# EAGLE board genesys (EAGLE 9.5.1), part 1 of 2
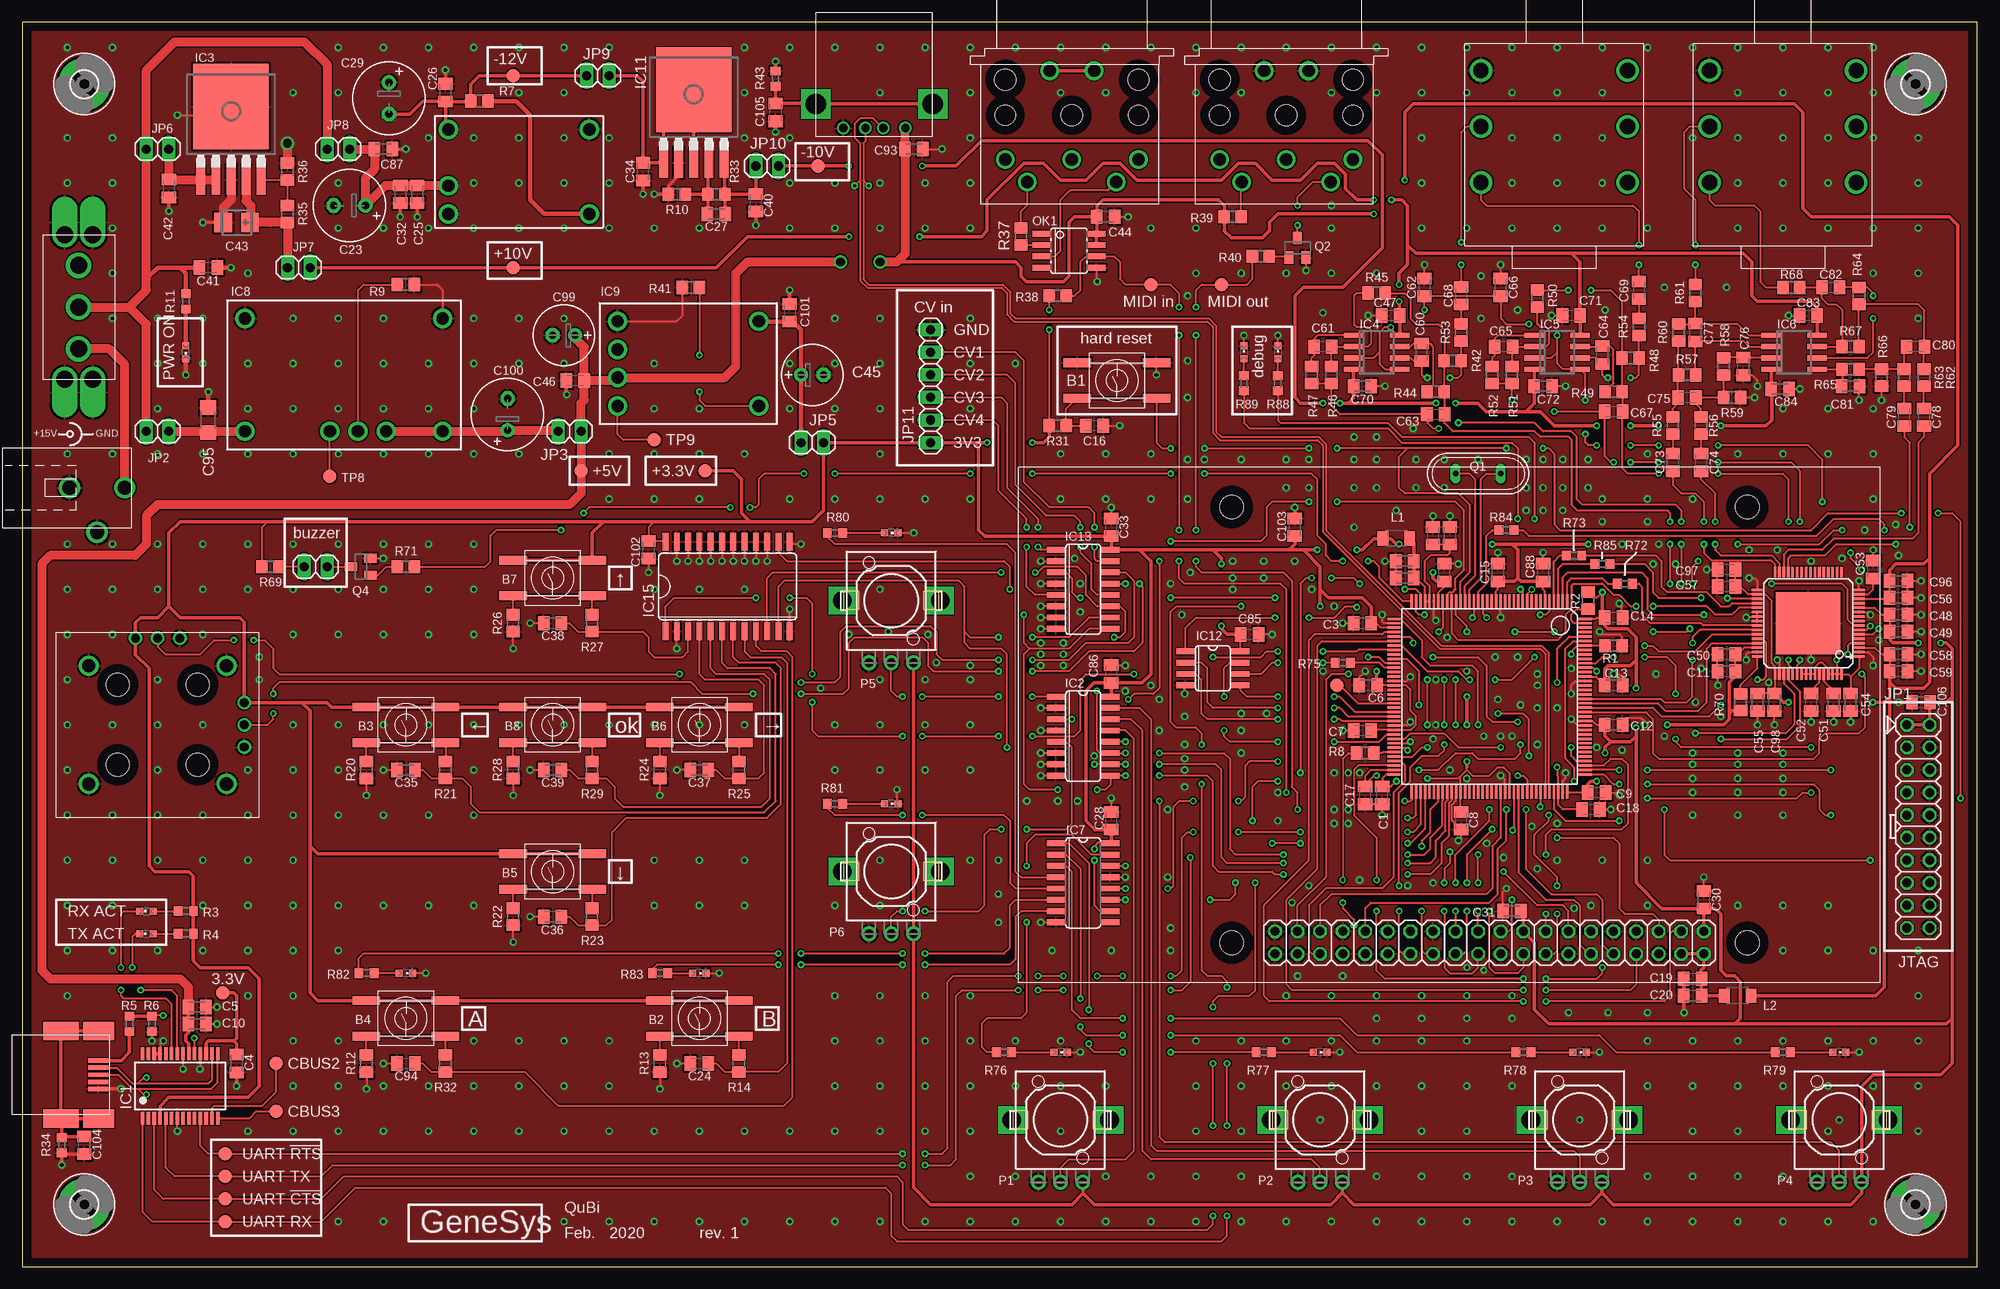
[diagram p16: board, top side]
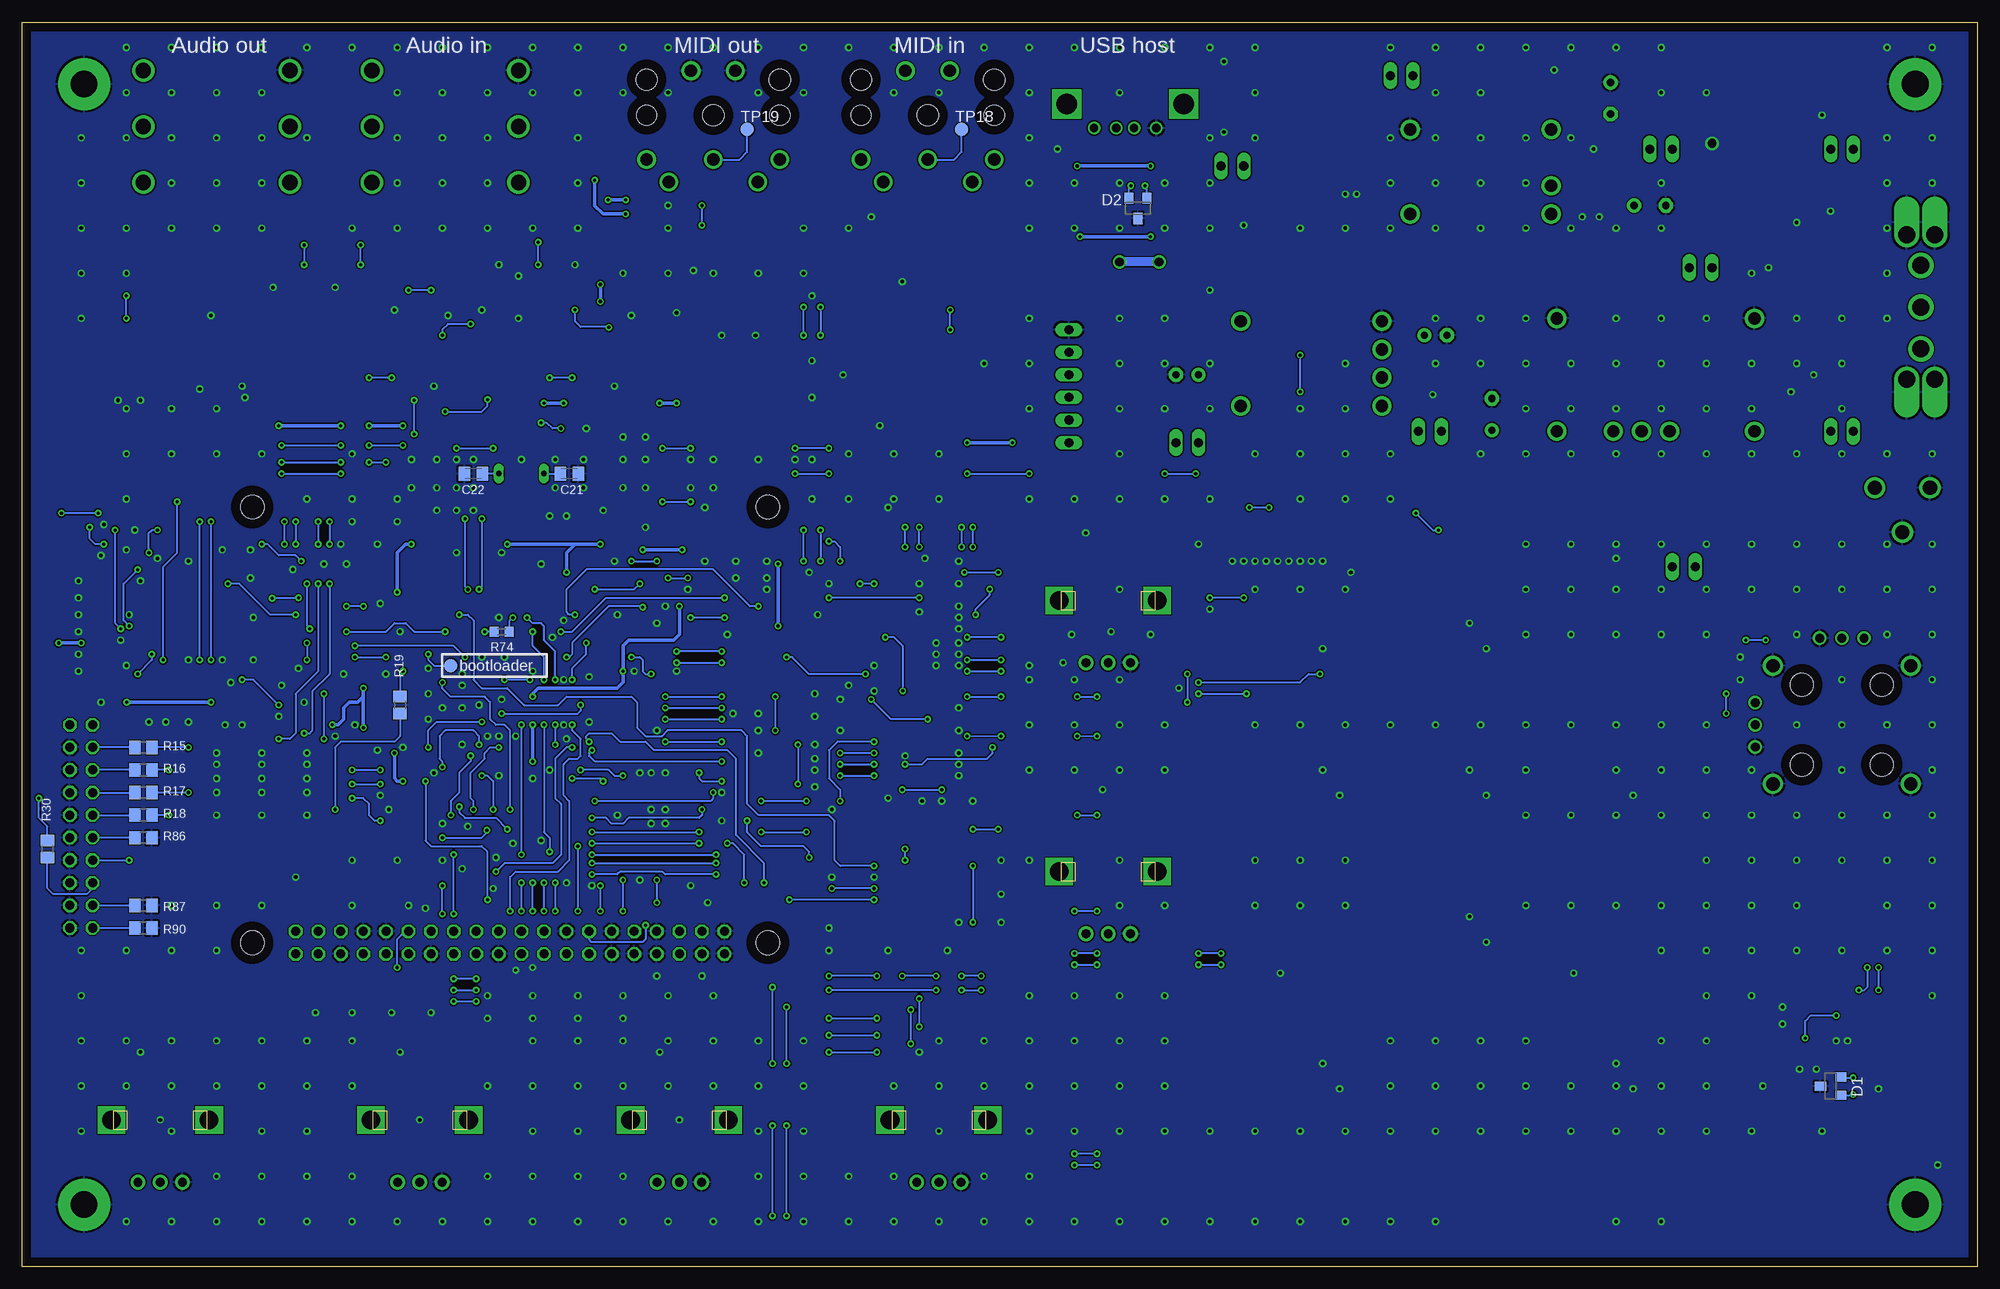
[diagram p17: board, bottom side, seen from below]

Size 220 x 140 mm. Coordinates in mm from the lower left corner, seen from the top.
Outline: 0,0 220,0 220,140 0,140 0,0
Copper layers (1*16): Top 0.035mm / dielectric 1.5mm / Bottom 0.035mm
Design rules "jlcpcb": minimum track width 5mil, minimum drill 0.3mm, track to track 6mil, track to pad 6mil, pad to pad 6mil, via to via 6mil, smd to smd 6mil, copper to edge 40mil, drill to drill 6mil, minimum pad ring 10mil, minimum via ring 8mil, stop-mask expansion 4mil, vias tented up to drill 0mil, thermal gap 10mil
Net classes: 1 USB diff pair: width 0.203 mm, clearance 0.025 mm

## Footprints (pad centres in the part's own frame; a part is rotated, then mirrored left to right if it is on the bottom)
KSC521G = smd 3.1 x 1: 1 -4.45,2; 2 4.45,2; 3 4.45,-2; 4 -4.45,-2
C0805K = smd 1.3 x 1.6: 1 -1,0; 2 1,0
E3,5-8 = drill 0.813 pad 1.6: + -1.778,0 | drill 0.813 pad 1.6 octagon: - 1.778,0
CT3528 = smd 2 x 2.2: + -1.5,0; - 1.5,0
E2,5-7 = drill 0.813 pad 1.6: + -1.27,0 | drill 0.813 pad 1.6 octagon: - 1.27,0
C1206 = smd 1.6 x 1.8: 1 -1.4,0; 2 1.4,0
SOT23 = smd 1.016 x 1.27: 1 -1.016,-1.143; 2 1.016,-1.143; 3 0,1.143
3,0-PAD = drill 3 pad 5.842: B3,0 0,0
SSOP28 = smd 0.4 x 1.5: 1 -4.225,-3.625; 2 -3.575,-3.625; 3 -2.925,-3.625; 4 -2.275,-3.625; 5 -1.625,-3.625; 6 -0.975,-3.625; 7 -0.325,-3.625; 8 0.325,-3.625; 9 0.975,-3.625; 10 1.625,-3.625; 11 2.275,-3.625; 12 2.925,-3.625; 13 3.575,-3.625; 14 4.225,-3.625; 15 4.225,3.625; 16 3.575,3.625; 17 2.925,3.625; 18 2.275,3.625; 19 1.625,3.625; 20 0.975,3.625; 21 0.325,3.625; 22 -0.325,3.625; 23 -0.975,3.625; 24 -1.625,3.625; 25 -2.275,3.625; 26 -2.925,3.625; 27 -3.575,3.625; 28 -4.225,3.625
SO16 = smd 0.66 x 2.032: 1 -4.445,-3.073; 2 -3.175,-3.073; 3 -1.905,-3.073; 4 -0.635,-3.073; 5 0.635,-3.073; 6 1.905,-3.073; 7 3.175,-3.073; 8 4.445,-3.073; 9 4.445,3.073; 10 3.175,3.073; 11 1.905,3.073; 12 0.635,3.073; 13 -0.635,3.073; 14 -1.905,3.073; 15 -3.175,3.073; 16 -4.445,3.073
Q5-DD = smd 1 x 3.4: 1 -3.4,-7.875; 2 -1.7,-7.875; 3 0,-7.875; 4 1.7,-7.875; 5 3.4,-7.875 | smd 8.5 x 9.6: 6 0,0.325
SO08 = smd 0.6 x 2.2: 1 -1.905,-2.6; 2 -0.635,-2.6; 3 0.635,-2.6; 4 1.905,-2.6; 5 1.905,2.6; 6 0.635,2.6; 7 -0.635,2.6; 8 -1.905,2.6
R-PDSS-T7 = drill 1.397 pad 2.184: 1 -11.113,6.35; 2 -11.113,-6.35; 3 -1.587,-6.35; 4 1.587,-6.35; 5 4.763,-6.35; 6 11.113,-6.35; 7 11.113,6.35
R-PDSS-T6 = drill 1.397 pad 2.184: 1 -7.938,4.763; 2 -7.938,1.587; 3 -7.938,-1.587; 4 -7.938,-4.763; 5 7.938,-4.763; 6 7.938,4.763
R-PDSS-T5 = drill 1.397 pad 2.184: 1 -7.938,4.763; 2 -7.938,-1.587; 3 -7.938,-4.763; 4 7.938,-4.763; 5 7.938,4.763
Q5-DD' = smd 1 x 3.4: 1 -3.4,-5.335; 2 -1.7,-5.335; 3 0,-5.335; 4 1.7,-5.335; 5 3.4,-5.335 | smd 8.5 x 9.6: 6 0,2.865
SO8 = smd 0.66 x 2.032: 1 -1.905,-3.073; 2 -0.635,-3.073; 3 0.635,-3.073; 4 1.905,-3.073; 5 1.905,3.073; 6 0.635,3.073; 7 -0.635,3.073; 8 -1.905,3.073
SO24W = smd 0.66 x 2.032: 1 -6.985,-5.029; 2 -5.715,-5.029; 3 -4.445,-5.029; 4 -3.175,-5.029; 5 -1.905,-5.029; 6 -0.635,-5.029; 7 0.635,-5.029; 8 1.905,-5.029; 9 3.175,-5.029; 10 4.445,-5.029; 11 5.715,-5.029; 12 6.985,-5.029; 13 6.985,5.029; 14 5.715,5.029; 15 4.445,5.029; 16 3.175,5.029; 17 1.905,5.029; 18 0.635,5.029; 19 -0.635,5.029; 20 -1.905,5.029; 21 -3.175,5.029; 22 -4.445,5.029; 23 -5.715,5.029; 24 -6.985,5.029
56579-0579 = smd 2.25 x 0.5: DN 2.225,0.8; DP 2.225,0; GND 2.225,-1.6; NC 2.225,-0.8; VBUS 2.225,1.6 | smd 4 x 2.05: SHIELD@1 -2,4.925; SHIELD@4 -2,-4.925 | smd 3.5 x 2.05: SHIELD@2 2.25,4.925; SHIELD@3 2.25,-4.925
USB_A = drill 0.92: P1 -3.5,2.71; P2 -1,2.71; P3 1,2.71; P4 3.5,2.71 | drill 2.3 square: SHIELD@1 -6.57,0; SHIELD@2 6.57,0
JACK_6.35 = drill 1.7: P1 -8.25,-6.3; P2 -8.25,0; P3 -8.25,6.3; P4 8.25,-6.3; P5 8.25,0; P6 8.25,6.3
71251-050/0800 = drill 1.4: GND@1 -2.5,-5; GND@2 2.5,-5; P1 7.5,5; P2 0,5; P3 -7.5,5; P4 5,7.5; P5 -5,7.5 | hole 2.3: -7.5,0; 7.5,0 | hole 2.4: -7.5,-4; 7.5,-4; 0,0
DC-10LP = drill 1.6: P1 0,-6.45; P2 -5,-3.35; P3 0,-0.25
2X10 = drill 1.016 octagon: 1 -11.43,-1.27; 2 -11.43,1.27; 3 -8.89,-1.27; 4 -8.89,1.27; 5 -6.35,-1.27; 6 -6.35,1.27; 7 -3.81,-1.27; 8 -3.81,1.27; 9 -1.27,-1.27; 10 -1.27,1.27; 11 1.27,-1.27; 12 1.27,1.27; 13 3.81,-1.27; 14 3.81,1.27; 15 6.35,-1.27; 16 6.35,1.27; 17 8.89,-1.27; 18 8.89,1.27; 19 11.43,-1.27; 20 11.43,1.27
1X02 = drill 1.016 long: 1 -1.27,0; 2 1.27,0
1X06 = drill 1.016 long: 1 -6.35,0; 2 -3.81,0; 3 -1.27,0; 4 1.27,0; 5 3.81,0; 6 6.35,0
L3216C = smd 1.2 x 1.6: 1 -1.5,0; 2 1.5,0
CHIPLED_0603 = smd 0.8 x 0.8: A 0,-0.75; C 0,0.75
SOIC08 = smd 0.66 x 2.032: 1 -1.905,-3.073; 2 -0.635,-3.073; 3 0.635,-3.073; 4 1.905,-3.073; 5 1.905,3.073; 6 0.635,3.073; 7 -0.635,3.073; 8 -1.905,3.073
EVUFXM = drill 1 pad 1.676: 1 -2.5,-7; 2 0,-7; 3 2.5,-7 | drill 2.1 pad 2.8 square: M1 -5.5,0; M2 5.5,0
RKJXK1210002 = drill 1: PX1 2.5,9.75; PX2 0,9.75; PX3 -2.5,9.75; PY1 9.75,-2.5; PY2 9.75,0; PY3 9.75,2.5 | drill 1.5: SHIELD@1 -7.75,-6.65; SHIELD@2 -7.75,6.65; SHIELD@3 7.75,6.65; SHIELD@4 7.75,-6.65 | hole 2.6: -4.5,4.5; 4.5,4.5; 4.5,-4.5; -4.5,-4.5
QS = drill 0.61 long: 1 -2.54,0; 2 2.54,0
SOT23' = smd 1 x 1.4: 1 -0.95,-1.1; 2 0.95,-1.1; 3 0,1.1
R0805 = smd 1.3 x 1.5: 1 -0.95,0; 2 0.95,0
R0603 = smd 1 x 1.1: 1 -0.85,0; 2 0.85,0
SWITCH_1P = drill 1.905: P1 0,-4.699; P2 0,0; P3 0,4.699 | drill 1.905 offset: SHIELD@1 1.587,8.128; SHIELD@2 -1.587,8.128; SHIELD@3 -1.587,-8.128; SHIELD@4 1.587,-8.128
TP15R = smd 1.5 x 1.5: TP 0,0
TQFP144 = smd 0.27 x 1.5: 1 -8.75,-10.75; 2 -8.25,-10.75; 3 -7.75,-10.75; 4 -7.25,-10.75; 5 -6.75,-10.75; 6 -6.25,-10.75; 7 -5.75,-10.75; 8 -5.25,-10.75; 9 -4.75,-10.75; 10 -4.25,-10.75; 11 -3.75,-10.75; 12 -3.25,-10.75; 13 -2.75,-10.75; 14 -2.25,-10.75; 15 -1.75,-10.75; 16 -1.25,-10.75; 17 -0.75,-10.75; 18 -0.25,-10.75; 19 0.25,-10.75; 20 0.75,-10.75; 21 1.25,-10.75; 22 1.75,-10.75; 23 2.25,-10.75; 24 2.75,-10.75; 25 3.25,-10.75; 26 3.75,-10.75; 27 4.25,-10.75; 28 4.75,-10.75; 29 5.25,-10.75; 30 5.75,-10.75; 31 6.25,-10.75; 32 6.75,-10.75; 33 7.25,-10.75; 34 7.75,-10.75; 35 8.25,-10.75; 36 8.75,-10.75; 73 8.75,10.75; 74 8.25,10.75; 75 7.75,10.75; 76 7.25,10.75; 77 6.75,10.75; 78 6.25,10.75; 79 5.75,10.75; 80 5.25,10.75; 81 4.75,10.75; 82 4.25,10.75; 83 3.75,10.75; 84 3.25,10.75; 85 2.75,10.75; 86 2.25,10.75; 87 1.75,10.75; 88 1.25,10.75; 89 0.75,10.75; 90 0.25,10.75; 91 -0.25,10.75; 92 -0.75,10.75; 93 -1.25,10.75; 94 -1.75,10.75; 95 -2.25,10.75; 96 -2.75,10.75; 97 -3.25,10.75; 98 -3.75,10.75; 99 -4.25,10.75; 100 -4.75,10.75; 101 -5.25,10.75; 102 -5.75,10.75; 103 -6.25,10.75; 104 -6.75,10.75; 105 -7.25,10.75; 106 -7.75,10.75; 107 -8.25,10.75; 108 -8.75,10.75 | smd 1.5 x 0.27: 37 10.75,-8.75; 38 10.75,-8.25; 39 10.75,-7.75; 40 10.75,-7.25; 41 10.75,-6.75; 42 10.75,-6.25; 43 10.75,-5.75; 44 10.75,-5.25; 45 10.75,-4.75; 46 10.75,-4.25; 47 10.75,-3.75; 48 10.75,-3.25; 49 10.75,-2.75; 50 10.75,-2.25; 51 10.75,-1.75; 52 10.75,-1.25; 53 10.75,-0.75; 54 10.75,-0.25; 55 10.75,0.25; 56 10.75,0.75; 57 10.75,1.25; 58 10.75,1.75; 59 10.75,2.25; 60 10.75,2.75; 61 10.75,3.25; 62 10.75,3.75; 63 10.75,4.25; 64 10.75,4.75; 65 10.75,5.25; 66 10.75,5.75; 67 10.75,6.25; 68 10.75,6.75; 69 10.75,7.25; 70 10.75,7.75; 71 10.75,8.25; 72 10.75,8.75; 109 -10.75,8.75; 110 -10.75,8.25; 111 -10.75,7.75; 112 -10.75,7.25; 113 -10.75,6.75; 114 -10.75,6.25; 115 -10.75,5.75; 116 -10.75,5.25; 117 -10.75,4.75; 118 -10.75,4.25; 119 -10.75,3.75; 120 -10.75,3.25; 121 -10.75,2.75; 122 -10.75,2.25; 123 -10.75,1.75; 124 -10.75,1.25; 125 -10.75,0.75; 126 -10.75,0.25; 127 -10.75,-0.25; 128 -10.75,-0.75; 129 -10.75,-1.25; 130 -10.75,-1.75; 131 -10.75,-2.25; 132 -10.75,-2.75; 133 -10.75,-3.25; 134 -10.75,-3.75; 135 -10.75,-4.25; 136 -10.75,-4.75; 137 -10.75,-5.25; 138 -10.75,-5.75; 139 -10.75,-6.25; 140 -10.75,-6.75; 141 -10.75,-7.25; 142 -10.75,-7.75; 143 -10.75,-8.25; 144 -10.75,-8.75
HYPERPIXEL4.0 = drill 1.016 octagon: 1 -24.13,23.23; 2 -24.13,25.77; 3 -21.59,23.23; 4 -21.59,25.77; 5 -19.05,23.23; 6 -19.05,25.77; 7 -16.51,23.23; 8 -16.51,25.77; 9 -13.97,23.23; 10 -13.97,25.77; 11 -11.43,23.23; 12 -11.43,25.77; 13 -8.89,23.23; 14 -8.89,25.77; 15 -6.35,23.23; 16 -6.35,25.77; 17 -3.81,23.23; 18 -3.81,25.77; 19 -1.27,23.23; 20 -1.27,25.77; 21 1.27,23.23; 22 1.27,25.77; 23 3.81,23.23; 24 3.81,25.77; 25 6.35,23.23; 26 6.35,25.77; 27 8.89,23.23; 28 8.89,25.77; 29 11.43,23.23; 30 11.43,25.77; 31 13.97,23.23; 32 13.97,25.77; 33 16.51,23.23; 34 16.51,25.77; 35 19.05,23.23; 36 19.05,25.77; 37 21.59,23.23; 38 21.59,25.77; 39 24.13,23.23; 40 24.13,25.77 | hole 2.7: 29,-24.5; 29,24.5; -29,24.5; -29,-24.5
HTQFP64 = smd 1.2 x 0.3: 1 -5.75,3.75; 2 -5.75,3.25; 3 -5.75,2.75; 4 -5.75,2.25; 5 -5.75,1.75; 6 -5.75,1.25; 7 -5.75,0.75; 8 -5.75,0.25; 9 -5.75,-0.25; 10 -5.75,-0.75; 11 -5.75,-1.25; 12 -5.75,-1.75; 13 -5.75,-2.25; 14 -5.75,-2.75; 15 -5.75,-3.25; 16 -5.75,-3.75; 33 5.75,-3.75; 34 5.75,-3.25; 35 5.75,-2.75; 36 5.75,-2.25; 37 5.75,-1.75; 38 5.75,-1.25; 39 5.75,-0.75; 40 5.75,-0.25; 41 5.75,0.25; 42 5.75,0.75; 43 5.75,1.25; 44 5.75,1.75; 45 5.75,2.25; 46 5.75,2.75; 47 5.75,3.25; 48 5.75,3.75 | smd 0.3 x 1.2: 17 -3.75,-5.75; 18 -3.25,-5.75; 19 -2.75,-5.75; 20 -2.25,-5.75; 21 -1.75,-5.75; 22 -1.25,-5.75; 23 -0.75,-5.75; 24 -0.25,-5.75; 25 0.25,-5.75; 26 0.75,-5.75; 27 1.25,-5.75; 28 1.75,-5.75; 29 2.25,-5.75; 30 2.75,-5.75; 31 3.25,-5.75; 32 3.75,-5.75; 49 3.75,5.75; 50 3.25,5.75; 51 2.75,5.75; 52 2.25,5.75; 53 1.75,5.75; 54 1.25,5.75; 55 0.75,5.75; 56 0.25,5.75; 57 -0.25,5.75; 58 -0.75,5.75; 59 -1.25,5.75; 60 -1.75,5.75; 61 -2.25,5.75; 62 -2.75,5.75; 63 -3.25,5.75; 64 -3.75,5.75 | smd 7.26 x 7: GND 0,0

## Placement (x,y rotation side)
B1  KSC521G  [KSC521G]  123.19,99.69 0 top
B2  KSC521G  [KSC521G]  76.2,27.94 0 top
B3  KSC521G  [KSC521G]  43.18,60.96 0 top
B4  KSC521G  [KSC521G]  43.18,27.94 0 top
B5  KSC521G  [KSC521G]  59.69,44.45 0 top
B6  KSC521G  [KSC521G]  76.2,60.96 0 top
B7  KSC521G  [KSC521G]  59.69,77.47 0 top
B8  KSC521G  [KSC521G]  59.69,60.96 0 top
C1  100n  [C0805K]  153.03,53.02 270 top
C2  100n  [C0805K]  160.02,78.11 90 top
C3  100n  [C0805K]  150.81,72.39 180 top
C4  100n  [C0805K]  24.13,22.86 270 top
C5  4.7µF  [C0805K]  19.68,29.21 0 top
C6  100n  [C0805K]  151.45,65.41 180 top
C7  100n  [C0805K]  150.81,60.33 180 top
C8  100n  [C0805K]  161.93,50.16 270 top
C9  100n  [C0805K]  177.16,53.34 0 top
C10  100n  [C0805K]  19.68,27.3 0 top
C11  10µF  [C0805K]  191.77,66.99 180 top
C12  100n  [C0805K]  179.07,60.96 0 top
C13  100n  [C0805K]  179.07,65.41 0 top
C14  100n  [C0805K]  179.07,73.03 0 top
C15  100n  [C0805K]  166.05,78.11 90 top
C16  100n  [C0805K]  120.65,94.61 0 top
C17  2.2µF  [C0805K]  151.13,53.02 270 top
C18  2.2µF  [C0805K]  176.53,51.44 0 top
C19  100n  [C0805K]  187.96,32.38 180 top
C20  10µF  [C0805K]  187.96,30.48 180 top
C21  5.6pF  [C0805K]  158.43,89.22 0 bottom
C22  5.6pF  [C0805K]  169.23,89.22 180 bottom
C23  180µF  [E3,5-8]  36.83,119.38 180 top
C24  100nF  [C0805K]  76.2,22.86 180 top
C25  4.7µF  [C0805K]  44.45,120.65 270 top
C26  4.7µF  [C0805K]  47.62,132.08 270 top
C27  10nF  [C0805K]  78.11,118.43 0 top
C28  100n  [C0805K]  122.56,50.16 90 top
C29  180µF  [E3,5-8]  41.27,131.44 270 top
C30  100n  [C0805K]  189.23,41.27 90 top
C31  100n  [C0805K]  167.64,40.01 180 top
C32  4.7µF  [C0805K]  42.55,120.65 270 top
C33  100n  [C0805K]  122.56,83.19 90 top
C34  10µF  [C0805K]  69.85,123.19 90 top
C35  100nF  [C0805K]  43.18,55.88 180 top
C36  100nF  [C0805K]  59.69,39.37 180 top
C37  100nF  [C0805K]  76.2,55.88 180 top
C38  100nF  [C0805K]  59.69,72.39 180 top
C39  100nF  [C0805K]  59.69,55.88 180 top
C40  10µF  [C0805K]  82.55,119.7 90 top
C41  100nF  [C0805K]  20.95,112.39 0 top
C42  10µF  [C0805K]  16.51,121.28 270 top
C43  22µF  [CT3528]  24.13,117.47 180 top
C44  100n  [C0805K]  121.92,118.11 0 top
C45  47µF  [E2,5-7]  88.9,100.33 0 top
C46  4.7µF  [C0805K]  62.23,99.69 180 top
C47  100n  [C0805K]  153.99,107 180 top
C48  1µF  [C0805K]  211.14,73.34 0 top
C49  10µF  [C0805K]  211.14,71.44 0 top
C50  1µF  [C0805K]  191.77,68.9 180 top
C51  10µF  [C0805K]  203.84,63.5 270 top
C52  10µF  [C0805K]  201.29,63.5 270 top
C53  10µF  [C0805K]  208.28,78.42 90 top
C54  10µF  [C0805K]  205.74,63.5 270 top
C55  1µF  [C0805K]  195.26,63.5 270 top
C56  1µF  [C0805K]  211.14,75.25 0 top
C57  1µF  [C0805K]  191.77,76.52 180 top
C58  1µF  [C0805K]  211.14,68.9 0 top
C59  10µF  [C0805K]  211.14,66.99 0 top
C60  2.2n  [C0805K]  157.48,102.87 90 top
C61  22p  [C0805K]  146.37,103.5 180 top
C62  100n  [C0805K]  157.8,110.17 270 top
C63  10n  [C0805K]  159.07,95.89 180 top
C64  2.2n  [C0805K]  177.8,102.55 90 top
C65  22p  [C0805K]  166.69,103.5 180 top
C66  100n  [C0805K]  166.37,110.17 270 top
C67  10n  [C0805K]  179.07,96.2 180 top
C68  10µF  [C0805K]  161.93,109.22 270 top
C69  10µF  [C0805K]  181.93,109.86 270 top
C70  100n  [C0805K]  150.81,99.06 180 top
C71  100n  [C0805K]  174.31,107 180 top
C72  100n  [C0805K]  171.13,99.06 180 top
C73  10µF  [C0805K]  185.74,90.49 90 top
C74  10µF  [C0805K]  188.91,90.49 90 top
C75  3.3nF  [C0805K]  187.32,97.79 180 top
C76  680pF  [C0805K]  193.68,101.28 90 top
C77  680pF  [C0805K]  188.28,105.09 270 top
C78  10µF  [C0805K]  214,95.57 90 top
C79  10µF  [C0805K]  211.77,95.57 90 top
C80  3.3nF  [C0805K]  213.04,103.5 0 top
C81  680pF  [C0805K]  205.74,99.06 180 top
C82  680pF  [C0805K]  203.52,110.17 0 top
C83  100n  [C0805K]  200.98,107 180 top
C84  100n  [C0805K]  197.8,98.74 180 top
C85  100n  [C0805K]  138.11,71.12 0 top
C86  100n  [C0805K]  122.56,66.67 90 top
C87  4.7µF  [C0805K]  40.64,125.73 0 top
C88  1µF  [C0805K]  171.13,78.11 90 top
C89  100n  [C0805K]  155.57,77.47 180 top
C90  100n  [C0805K]  160.66,82.23 90 top
C91  1µF  [C0805K]  155.57,79.38 180 top
C92  1µF  [C0805K]  158.75,82.23 90 top
C93  100n  [C0805K]  100.33,125.73 0 top
C94  100nF  [C0805K]  43.18,22.86 180 top
C95  2.2µF  [C1206]  20.95,95.25 90 top
C96  10µF  [C0805K]  211.14,77.15 0 top
C97  10µF  [C0805K]  191.77,78.42 180 top
C98  10µF  [C0805K]  197.17,63.5 270 top
C99  47µF  [E2,5-7]  60.96,104.78 180 top
C100  180µF  [E3,5-8]  54.61,95.89 90 top
C101  4.7µF  [C0805K]  86.36,107.31 90 top
C102  100n  [C0805K]  70.48,80.64 270 top
C103  4.7µF  [C0805K]  143.19,83.19 90 top
C104  100n  [C0805K]  6.99,13.65 270 top
C105  100n  [C0805K]  84.77,129.86 270 top
C106  100n  [C0805K]  213.68,63.5 180 top
D1  PGB002ST23  [SOT23]  16.51,20.32 90 bottom
D2  PGB002ST23  [SOT23]  94.46,119.06 180 bottom
H1  MOUNT-PAD-ROUND3.0  [3,0-PAD]  6.99,6.99 0 top
H2  MOUNT-PAD-ROUND3.0  [3,0-PAD]  213.04,6.99 0 top
H3  MOUNT-PAD-ROUND3.0  [3,0-PAD]  213.04,133.03 0 top
H4  MOUNT-PAD-ROUND3.0  [3,0-PAD]  6.99,133.03 0 top
IC1  FT232RL  [SSOP28]  17.78,20.32 0 top
IC2  4051D  [SO16]  119.38,59.69 270 top
IC3  LT1963AEQ  [Q5-DD]  23.5,130.18 0 top
IC4  NE5532D  [SO08]  152.4,102.87 270 top
IC5  NE5532D  [SO08]  172.72,102.87 270 top
IC6  NE5532D  [SO08]  199.39,102.87 270 top
IC7  74HC595D  [SO16]  119.38,43.18 270 top
IC8  PTN78060W  [R-PDSS-T7]  36.2,100.33 0 top
IC9  PTH04000W  [R-PDSS-T6]  74.93,101.6 0 top
IC10  PTN78000A  [R-PDSS-T5]  55.88,123.19 0 top
IC11  LT3015  [Q5-DD']  75.56,129.54 0 top
IC12  S25FL127S  [SO8]  133.99,67.31 270 top
IC13  4051D  [SO16]  119.38,76.2 270 top
IC15  4067D  [SO24W]  79.38,76.52 0 top
J1  MINI-USB-5  [56579-0579]  6.35,21.59 0 top
J2  USB_A  [USB_A]  95.89,130.81 180 top
J3  JACK_6.35  [JACK_6.35]  172.4,128.27 180 top
J4  JACK_6.35  [JACK_6.35]  198.12,128.27 180 top
J5  DIN_5PINS  [71251-050/0800]  118.11,129.54 180 top
J6  DIN_5PINS  [71251-050/0800]  142.24,129.54 180 top
J7  JACK_SUPPLY  [DC-10LP]  5.08,87.63 90 top
JP1  [2X10]  213.36,49.53 270 top
JP2  [1X02]  15.24,93.98 0 top
JP3  [1X02]  61.59,93.98 0 top
JP4  [1X02]  33.02,78.74 0 top
JP5  [1X02]  88.9,92.71 0 top
JP6  [1X02]  15.24,125.73 0 top
JP7  [1X02]  31.11,112.39 0 top
JP8  [1X02]  35.56,125.73 0 top
JP9  [1X02]  64.77,133.99 0 top
JP10  [1X02]  83.82,123.83 0 top
JP11  [1X06]  102.23,99.06 90 top
L1  [L3216C]  154.62,81.92 180 top
L2  [L3216C]  193.04,30.48 180 top
LED1  TX_LED  [CHIPLED_0603]  13.97,40.01 90 top
LED2  RX_LED  [CHIPLED_0603]  13.97,37.47 90 top
LED3  USR_LED_1  [CHIPLED_0603]  116.84,24.13 270 top
LED4  USR_LED_2  [CHIPLED_0603]  146.05,24.13 270 top
LED5  USR_LED_3  [CHIPLED_0603]  175.26,24.13 270 top
LED6  USR_LED_4  [CHIPLED_0603]  204.47,24.13 270 top
LED7  USR_LED_5  [CHIPLED_0603]  97.79,82.55 270 top
LED8  USR_LED_6  [CHIPLED_0603]  97.79,52.07 270 top
LED9  USR_LED_7  [CHIPLED_0603]  43.18,33.02 270 top
LED10  USR_LED_8  [CHIPLED_0603]  76.2,33.02 270 top
LED11  ON_LED  [CHIPLED_0603]  18.41,102.87 180 top
LED12  USR_LED_1  [CHIPLED_0603]  137.48,102.87 0 top
LED13  USR_LED_1  [CHIPLED_0603]  141.29,102.87 0 top
OK1  HCPL0600  [SOIC08]  117.79,114.3 270 top
P1  PTV09F2M  [EVUFXM]  116.84,16.51 0 top
P2  PTV09F2M  [EVUFXM]  146.05,16.51 0 top
P3  PTV09F2M  [EVUFXM]  175.26,16.51 0 top
P4  PTV09F2M  [EVUFXM]  204.47,16.51 0 top
P5  PTV09F2M  [EVUFXM]  97.79,74.93 0 top
P6  PTV09F2M  [EVUFXM]  97.79,44.45 0 top
P7  JOYSTICK_XY  [RKJXK1210002]  15.24,60.96 0 top
Q1  25MHz  [QS]  163.83,89.22 0 top
Q2  BC847CSMD  [SOT23']  143.51,114.62 0 top
Q4  BC847CSMD  [SOT23']  38.1,78.74 90 top
R1  10k  [R0805]  179.07,69.85 180 top
R2  10k  [R0805]  176.21,74.93 270 top
R3  270  [R0603]  18.41,40.01 0 top
R4  270  [R0603]  18.41,37.47 0 top
R5  4.7k  [R0603]  12.06,27.3 270 top
R6  10k  [R0603]  14.61,27.3 90 top
R7  2k  [R0805]  51.44,131.13 0 top
R8  50  [R0805]  151.13,57.78 0 top
R9  21k  [R0805]  43.18,110.49 0 top
R10  1.5k  [R0805]  73.66,120.65 180 top
R11  2.2k  [R0603]  18.41,108.58 90 top
R12  10k  [R0805]  38.73,22.86 270 top
R13  10k  [R0805]  71.75,22.86 270 top
R14  330  [R0805]  80.64,22.86 90 top
R15  22  [R0805]  206.38,58.42 180 bottom
R16  22  [R0805]  206.38,55.88 180 bottom
R17  22  [R0805]  206.38,53.34 180 bottom
R18  22  [R0805]  206.38,50.8 180 bottom
R19  22  [R0805]  177.48,63.18 270 bottom
R20  10k  [R0805]  38.73,55.88 270 top
R21  330  [R0805]  47.62,55.88 90 top
R22  10k  [R0805]  55.24,39.37 270 top
R23  330  [R0805]  64.14,39.37 90 top
R24  10k  [R0805]  71.75,55.88 270 top
R25  330  [R0805]  80.64,55.88 90 top
R26  10k  [R0805]  55.24,72.39 270 top
R27  330  [R0805]  64.14,72.39 90 top
R28  10k  [R0805]  55.24,55.88 270 top
R29  330  [R0805]  64.14,55.88 90 top
R30  22  [R0805]  217.17,46.99 270 bottom
R31  10k  [R0805]  116.52,94.61 180 top
R32  330  [R0805]  47.62,22.86 90 top
R33  11k  [R0805]  78.11,120.65 180 top
R34  1M  [R0603]  4.45,13.65 90 top
R35  11k  [R0805]  29.84,118.43 270 top
R36  1.5k  [R0805]  29.84,123.19 270 top
R37  330  [R0805]  112.39,115.89 270 top
R38  4.7k  [R0805]  116.52,109.22 180 top
R39  330  [R0805]  136.21,118.11 180 top
R40  4.7k  [R0805]  139.38,113.67 180 top
R41  475  [R0805]  75.25,110.17 180 top
R42  1.5k  [R0805]  160.97,101.92 0 top
R43  1M  [R0603]  84.77,133.67 90 top
R44  47  [R0805]  159.07,98.42 180 top
R45  1.5k  [R0805]  152.4,109.54 0 top
R46  1.5k  [R0805]  147.32,100.33 90 top
R47  47  [R0805]  145.1,100.33 90 top
R48  1.5k  [R0805]  180.97,102.23 0 top
R49  47  [R0805]  179.07,98.42 180 top
R50  1.5k  [R0805]  170.5,108.9 90 top
R51  1.5k  [R0805]  167.64,100.33 90 top
R52  47  [R0805]  165.42,100.33 90 top
R53  3k  [R0805]  161.93,105.09 90 top
R54  3k  [R0805]  181.93,105.73 90 top
R55  7.5k  [R0805]  185.74,94.61 270 top
R56  7.5k  [R0805]  188.91,94.61 270 top
R57  360  [R0805]  187.32,100.33 180 top
R58  360  [R0805]  191.45,101.28 270 top
R59  5.6k  [R0805]  192.41,97.79 0 top
R60  5.6k  [R0805]  186.37,105.09 270 top
R61  47  [R0805]  188.28,109.54 270 top
R62  7.5k  [R0805]  214,100.01 270 top
R63  7.5k  [R0805]  211.77,100.01 270 top
R64  360  [R0805]  206.69,109.22 270 top
R65  360  [R0805]  205.74,100.97 0 top
R66  5.6k  [R0805]  209.23,100.01 270 top
R67  5.6k  [R0805]  205.74,103.5 0 top
R68  47  [R0805]  199.07,110.17 0 top
R69  4.7k  [R0805]  27.94,78.74 0 top
R70  0  [R0805]  193.36,63.5 90 top
R71  4.7k  [R0805]  43.18,78.74 0 top
R72  50  [R0603]  180.34,76.83 180 top
R73  50  [R0603]  174.62,80.01 180 top
R74  50  [R0603]  166.05,71.44 0 bottom
R75  50  [R0603]  148.59,67.94 0 top
R76  270  [R0603]  110.49,24.13 180 top
R77  270  [R0603]  139.7,24.13 180 top
R78  270  [R0603]  168.91,24.13 180 top
R79  270  [R0603]  198.12,24.13 180 top
R80  270  [R0603]  91.44,82.55 180 top
R81  270  [R0603]  91.44,52.07 180 top
R82  270  [R0603]  38.73,33.02 180 top
R83  270  [R0603]  71.75,33.02 180 top
R84  50  [R0603]  167,82.87 180 top
R85  50  [R0603]  177.8,79.06 180 top
R86  10k  [R0805]  206.38,48.26 180 bottom
R87  10k  [R0805]  206.38,40.64 180 bottom
R88  270  [R0603]  141.29,99.38 270 top
R89  270  [R0603]  137.48,99.38 270 top
R90  10k  [R0805]  206.38,38.1 180 bottom
S1  SWITCH_1P  [SWITCH_1P]  6.35,107.95 0 top
TP1  TPTP15R  [TP15R]  22.86,5.08 0 top
TP2  TPTP15R  [TP15R]  22.86,10.16 0 top
TP3  TPTP15R  [TP15R]  22.86,7.62 0 top
TP4  TPTP15R  [TP15R]  22.86,12.7 0 top
TP5  TPTP15R  [TP15R]  22.54,30.8 0 top
TP6  TPTP15R  [TP15R]  28.57,22.86 0 top
TP7  TPTP15R  [TP15R]  28.57,17.46 0 top
TP8  TPTP15R  [TP15R]  34.61,88.9 0 top
TP9  TPTP15R  [TP15R]  71.12,93.03 0 top
TP10  TPTP15R  [TP15R]  127,110.49 180 top
TP11  TPTP15R  [TP15R]  134.94,110.49 0 top
TP12  TPTP15R  [TP15R]  62.87,89.53 0 top
TP13  TPTP15R  [TP15R]  76.83,89.53 0 top
TP14  TPTP15R  [TP15R]  55.24,112.39 0 top
TP15  TPTP15R  [TP15R]  55.24,133.99 0 top
TP16  TPTP15R  [TP15R]  89.53,123.83 0 top
TP17  TPTP15R  [TP15R]  147.96,65.41 0 top
TP18  TPTP15R  [TP15R]  114.3,127.95 0 bottom
TP19  TPTP15R  [TP15R]  138.43,127.95 0 bottom
TP20  TPTP15R  [TP15R]  171.77,67.63 0 bottom
U$1  STM32H743ZI  [TQFP144]  165.1,64.14 180 top
U$2  HYPERPIXEL4.0  [HYPERPIXEL4.0]  165.1,60.96 180 top
U$8  PCM3168A  [HTQFP64]  200.98,72.39 180 top

## Tracks (layer width: path | path; a pad name or v marks a point on that pad's centre or on a via)
+3V3  (via drill 0.35)
  Top 0.203: C7.1 151.87,60.38 U$1.62 156.27,60.38 156.84,60.96 156.84,61.91 156.21,62.55 156.21,64.9 155.73,65.39 U$1.52 152.47,65.39 C6.1 | U$1.144 177.03,72.89 177.16,73.03 C14.1 | C8.1 161.85,51.24 U$1.84 161.85,55.17 | 207.01,9.51 P4.3 | U$1.72 153.49,55.38 153.03,54.93 C1.1 154.03,54.02 v154.62,54.61 | U$1.6 171.35,75.98 171.13,76.2 C88.1 | U$1.121 176.74,61.38 177.16,60.96 C12.1 | U$1.131 177.09,66.39 C13.1 | U$1.39 152.91,71.89 152.4,72.39 C3.1 | C9.1 173.9,53.34 U$1.108 | U$1.30 159.35,75.85 160.02,76.52 C2.1 | 162.56,55.88 162.56,56.2 | 162.56,55.88 163.19,55.24 165.1,55.24 166.05,56.2 166.69,56.2 167.35,55.53 U$1.95 | IC15.24 72.29,81.64 C102.1 70.48,83.19 71.12,83.82 | IC7.10 121.28,40.01 120.65,40.64 v120.65,45.72 | 122.56,47.73 121.07,47.73 120.65,47.31 v120.65,46.99 | IC12.8 137.06,71.07 C85.1 | 162.56,55.88 161.85,55.17 | 161.85,55.17 161.61,54.93 v158.12,54.93 | U$8.12 208.44,74.14 209.23,73.34 C48.1 C49.1 | U$8.46 193.78,69.64 192.77,68.63 C50.1 C11.1 | R31.2 v115.57,105.41 | v115.57,107.63 R38.2 | v177.8,75.88 177.16,75.25 176.84,75.25 R2.1 | U$1.17 165.85,76 166.05,76.2 C15.1 | R69.1 26.99,83.19 27.62,83.82
  Top 0.305: 122.56,80.75 IC13.16
  Top 0.406: C31.1 168.91,39.73 U$2.17 170.18,36.46 170.18,28.89 171.77,27.3 192.72,27.3 | P3.3 177.76,8.29 | 177.76,8.29 179.07,6.99 205.74,6.99 207.01,8.26 207.01,9.51 | 177.76,8.29 176.45,6.99 149.86,6.99 148.55,8.29 | 148.55,8.29 P2.3 | 148.55,8.29 147.24,6.99 120.65,6.99 119.38,8.26 | P4.3 207.01,9.55 207.01,20.32 208.28,21.59 215.9,21.59 217.17,22.86 217.17,27.94 | 217.17,27.94 216.53,27.3 192.72,27.3 | 107,92.71 JP11.1 JP5.2 90.17,85.09 88.9,83.82 81.92,83.82 | 107,92.71 107.63,92.08 107.63,82.87 108.31,82.19 C33.1 122.56,80.75 | IC13.16 125.73,80.64 | 125.73,80.64 133.99,80.64 | 133.99,80.64 142.56,80.64 | 142.56,80.64 144.15,80.64 | C3.1 151.81,74.25 150.81,75.25 147,75.25 146.05,76.2 | 146.05,76.2 146.05,78.74 144.15,80.64 | 146.05,76.2 v146.05,74.3 | 144.15,80.64 v145.73,80.64 | v150.18,80.64 150.81,80.64 152.08,81.92 L1.2 153.99,81.92 154.62,81.28 v154.94,81.28 | v177.8,75.88 177.8,73.3 C14.1 178.07,72.12 178.44,71.75 180.66,71.75 181.61,70.8 181.61,68.26 | 181.61,68.26 180.97,67.63 178.44,67.63 178.07,67.26 C13.1 | v162.56,64.14 v162.56,60.96 | 181.61,68.26 v181.61,65.09 | v181.61,60.64 181.61,59.69 | 181.61,59.69 180.97,59.05 178.75,59.05 | 178.75,59.05 178.07,59.74 C12.1 | C30.1 184.51,40.27 181.61,43.18 181.61,59.69 | C30.1 U$2.1 | 217.17,27.94 217.17,64.14 | 217.17,64.14 217.17,69.53 216.53,70.17 v215.9,70.17 | JP1.1 JP1.2 214.68,61.01 C106.1 216.53,63.5 217.17,64.14 | 125.73,80.64 127,79.38 127,66.67 126,65.67 C86.1 | C86.1 122.56,64.24 IC2.16 | C86.1 120.6,65.67 119.7,64.77 119.7,50.16 120.7,49.16 C28.1 122.56,47.73 IC7.16 | 81.92,83.82 71.12,83.82 65.41,83.82 | 65.41,83.82 64.14,82.56 B7.2 B7.1
  Top 0.406: 65.41,83.82 27.62,83.82 17.78,83.82 16.51,82.55 16.51,74.3 | IC1.4 15.51,18.05 16.51,19.05 25.4,19.05 26.67,20.32 26.67,32.38 25.4,33.66 20,33.66 19.27,34.39 R4.2 R3.2 19.27,43.92 18.73,44.45 14.92,44.45 14.29,45.09 14.29,67.31 12.74,68.86 P7.PX3 12.74,72.43 13.34,73.03 15.24,73.03 16.51,74.3 | 31.47,63.46 P7.PY3 24.99,72.48 24.45,73.03 17.78,73.03 16.51,74.3 | 31.47,63.46 32.38,62.55 32.38,47.31 | 32.38,47.31 32.38,30.8 33.24,29.94 B4.1 B4.2 B2.1 B2.2 | 119.38,8.26 118.11,6.99 102.23,6.99 100.29,8.93 P6.3 P5.3 | 119.38,8.26 119.38,9.47 P1.3 | 178.75,59.05 178.12,58.42 v178.12,57.78 | C9.1 176.16,54.24 176.53,54.61 v177.16,54.61 | C2.1 159.12,77.11 158.75,77.47 v158.75,78.11 | 162.56,56.2 v162.56,56.83 | 167.64,81.28 v165.42,81.28 | C30.1 190.55,40.27 191.13,39.69 191.13,33.34 191.77,32.7 192.72,32.7 193.36,32.07 193.36,27.94 192.72,27.3 | B6.2 B6.1 B8.2 B8.1 B3.2 B3.1 34.83,62.96 34.33,63.46 31.47,63.46 | B5.2 B5.1 33.24,46.45 32.38,47.31 | TP13.TP 80.01,89.53 80.96,88.58 80.96,84.77 81.92,83.82 | v185.1,60.96 191.45,60.96 192.09,61.59 192.09,62.23 | 192.09,62.23 192.09,65.72 192.77,66.41 C11.1 | 107,92.71 v108.58,92.71 | R31.2 115.57,93.35 114.94,92.71 v113.67,92.71 | 133.99,80.64 134.94,79.69 v134.94,79.06 | v134.94,72.07 134.94,71.75 135.57,71.12 C85.1 | C49.1 210.19,71.39 210.19,70.48 210.5,70.17 v213.36,70.17 | C88.1 168.64,77.11 168.28,77.47 | 168.28,77.47 167.91,77.11 C15.1 | 167.64,81.28 168.28,80.64 168.28,77.47 | 142.56,80.64 143.19,81.28 C103.1 | R70.1 192.41,62.55 192.09,62.23 | 167.64,81.28 v176.21,81.28 | C6.1 152.4,65.45 v152.4,66.99
  Bottom 0.203: v154.62,54.61 154.94,54.93 v158.12,54.93 | v120.65,45.72 v120.65,46.99 | v115.57,105.41 v115.57,107.63
  Bottom 0.406: v145.73,80.64 v150.18,80.64 | 157.8,81.28 v165.42,81.28 | v146.05,74.3 146.05,71.12 146.69,70.48 151.76,70.48 152.4,69.85 v152.4,66.99 152.4,65.72 153.03,65.09 161.93,65.09 162.56,64.45 v162.56,64.14 | v162.56,60.96 v162.56,56.83 | v181.61,65.09 181.61,64.14 | 181.61,64.14 v181.61,60.64 | 181.61,64.14 182.25,63.5 183.2,63.5 183.83,62.87 183.83,61.59 184.47,60.96 v185.1,60.96 | v177.16,54.61 177.8,54.61 178.12,54.93 v178.12,57.78 | 157.8,81.28 158.75,80.33 v158.75,78.11 | v177.8,75.88 177.8,80.33 176.85,81.28 v176.21,81.28 | v108.58,92.71 v113.67,92.71 | v134.94,79.06 v134.94,72.07 | v213.36,70.17 v215.9,70.17 | v154.94,81.28 157.8,81.28
+5V  (via drill 0.35, 1)
  Top 0.203: C55.1 C98.1 197.17,64.77 197.23,64.83 U$8.49 197.23,67.57 196.85,67.94 196.85,74.93 196.14,75.64 U$8.34 194.24,75.64 193.36,76.52 C57.1 C97.1 | U$8.14 210.03,75.14 C56.1 C96.1 | U$8.3 208.49,69.64 209.23,68.9 C58.1 210.14,67.31 C59.1
  Top 0.406: C5.1 C10.1 18.73,27.26 18.73,26.35 18.41,26.04 18.41,25.4 18.75,25.06 IC1.20 | C44.1 118.43,118.11 117.79,117.47 117.79,111.44 117.16,110.81 113.03,110.81 112.39,111.44 112.39,112.39 111.76,113.03 v96.52,113.03 | C44.1 120.92,116.26 OK1.8 OK1.7 | C44.1 120.92,119.33 121.6,120.02 134.62,120.02 135.26,119.38 R39.2 135.26,116.53 135.25,116.52 136.05,115.73 139.54,115.73 140.34,116.52 140.34,117.47 141.29,118.43 v152.08,118.43 | v155.57,122.24 155.57,129.86 156.53,130.81 199.39,130.81 200.34,129.86 200.34,119.06 201.29,118.11 216.85,118.11 217.81,117.16 217.81,92.39 214.63,89.22 214.63,79.69 | C96.1 210.14,78.38 210.82,79.06 214,79.06 214.63,79.69 | 214.63,79.69 214.63,65.72 214,65.09 210.82,65.09 210.14,65.77 | 210.14,65.77 210.14,67.31 | 210.14,64.14 210.14,60.59 209.55,60.01 209.55,31.43 208.6,30.48 L2.1 | 210.14,64.14 210.14,65.77 | C98.1 198.17,63.5 v198.75,63.5 | 210.14,64.14 209.5,63.5 v208.25,63.5
  Top 1.016: C5.1 18.68,31.48 17.78,32.38 3.17,32.38 2.22,33.34 2.22,79.06 3.17,80.01 12.7,80.01 13.97,81.28 13.97,84.45 15.24,85.72 61.59,85.72 62.87,87 TP12.TP JP3.2 62.87,97.16 63.23,97.52 C46.1 | C46.1 63.23,103.46 62.23,104.46 C99.+ | C46.1 66.67,99.69 IC9.3 79.06,100.01 80.33,101.28 80.33,111.76 81.6,113.03 v92.08,113.03 | v96.52,113.03 98.42,113.03 99.38,113.98 99.38,125.68 C93.1 99.33,128.04 J2.P1
  Bottom 0.406: v155.57,122.24 155.57,119.38 154.62,118.43 v152.08,118.43 | v208.25,63.5 v198.75,63.5
  Bottom 1.016: v92.08,113.03 v96.52,113.03
+10V  (via drill 0.35)
  Top 0.406: JP7.2 TP14.TP 78.11,112.39 81.6,115.89 v93.03,115.89 | v100.97,115.89 107.95,115.89 108.58,116.52 108.58,120.02 112.71,124.14 114.94,124.14 116.84,122.24 119.7,122.24 121.6,124.14 123.51,124.14 125.41,122.24 134.94,122.24 136.84,124.14 138.75,124.14 140.65,122.24 143.83,122.24 145.73,124.14 147.64,124.14 148.91,122.87 148.91,121.28 150.18,120.02 v152.08,120.02 | v154.06,120.02 155.26,120.02 155.89,119.38 155.89,114.94 | v154.94,110.49 154.94,111.76 155.89,112.71 155.89,114.94 | v154.94,108.58 154.99,108.54 C47.1 155,106.98 IC4.8 | 155.89,114.94 156.84,113.98 174.31,113.98 | IC6.8 201.98,104.79 C83.1 201.98,107.9 201.29,108.58 195.26,108.58 194.63,109.22 194.63,113.03 193.68,113.98 174.31,113.98 | IC5.8 175.31,104.79 C71.1 175.26,106.95 175.26,113.03 174.31,113.98
  Bottom 0.406: v93.03,115.89 v100.97,115.89 | v154.94,110.49 v154.94,108.58 | v152.08,120.02 v154.06,120.02
+12V
  Top 0.508: 13.97,111.12 15.24,112.39 17.78,112.39 | 17.78,112.39 18.41,111.76 R11.2 | C41.1 17.78,112.39
  Top 1.016: S1.P2 12.06,107.95 | 12.06,107.95 13.97,109.86 13.97,111.12 JP6.1 13.97,134.62 17.14,137.79 31.75,137.79 34.29,135.25 JP8.1 | 12.06,107.95 13.97,106.05 JP2.1
-10V  (via drill 0.35)
  Top 0.203: 170.13,100.95 IC5.4 | 149.81,100.95 IC4.4
  Top 0.406: JP10.2 TP16.TP v93.03,123.83 | v101.28,123.83 105.09,123.83 107.95,126.68 151.45,126.68 153.03,125.09 153.03,114.62 148.59,110.17 144.15,110.17 143.19,109.22 143.19,97.79 143.83,97.16 v146.37,97.16 | v148.27,97.16 149.22,97.16 | 149.22,97.16 149.81,97.74 C70.2 149.81,100.95 | 149.22,97.16 v159.07,97.16 | v161.29,97.16 163.83,97.16 164.78,96.2 169.23,96.2 | 169.23,96.2 170.13,97.11 C72.2 170.13,100.95 | v177.16,94.61 172.4,94.61 170.81,96.2 169.23,96.2 | v180.97,94.61 v184.15,94.61 | v191.13,94.61 196.22,94.61 196.85,95.25 196.85,98.69 C84.2 196.8,100.95 IC6.4
  Bottom 0.406: v101.28,123.83 v93.03,123.83 | v148.27,97.16 v146.37,97.16 | v159.07,97.16 v161.29,97.16 | v177.16,94.61 v180.97,94.61 | v184.15,94.61 v191.13,94.61
-12V
  Top 0.406: C29.- 43.62,129.67 45.09,131.13 47.58,131.13 C26.2 | C26.2 47.62,128.27 IC10.1 | C26.2 50.44,131.08 R7.1 50.48,133.03 51.44,133.99 TP15.TP JP9.1
ANALOG_INPUTS_1  (via drill 0.35)
  Top 0.203: IC2.3 v118.11,61.59 | U$1.28 160.35,75.63 160.61,75.89 160.98,75.89 161.29,76.2 161.29,77.47 162.24,78.42 162.24,85.09 161.29,86.04 v147.96,86.04 | v144.78,86.04 140.65,86.04 140.02,85.41 140.02,82.23 139.38,81.6 v129.22,81.6 | v124.46,63.82 125.09,64.45 127.32,64.45 127.95,65.09 v127.95,79.38
  Bottom 0.203: v147.96,86.04 v144.78,86.04 | v124.46,63.82 122.24,61.59 v118.11,61.59 | v129.22,81.6 128.59,81.6 127.95,80.96 v127.95,79.38
ANALOG_INPUTS_2  (via drill 0.35)
  Top 0.203: IC13.3 117.47,78.11 118.11,77.47 118.11,75.88 118.75,75.25 v119.06,75.25 | v140.97,75.25 v129.22,75.25 | U$1.29 159.85,71.9 v159.38,71.44
  Bottom 0.203: v159.38,71.44 158.12,71.44 154.31,75.25 v140.97,75.25 | v119.06,75.25 v129.22,75.25
AUDIO_I2S_BCLK_ADC  (via drill 0.35)
  Top 0.203: v183.51,71.44 187.32,71.44 v187.64,71.75 | v188.59,79.38 187.96,78.74 v187.96,76.83 | v204.79,82.87 203.84,82.87 202.25,81.28 v193.04,81.28 | U$8.7 207.53,71.64 v207.96,72.07 | v207.01,78.42 205.74,79.69 v205.74,80.33 | v167.96,71.44 v172.4,71.44
  Bottom 0.203: v183.51,71.44 179.07,71.44 178.12,72.39 176.85,72.39 175.9,71.44 v172.4,71.44 | v187.64,71.75 187.96,72.07 v187.96,76.83 | v188.59,79.38 189.23,80.01 191.13,80.01 192.41,81.28 v193.04,81.28 | v204.79,82.87 205.42,82.87 205.74,82.55 v205.74,80.33 | v207.96,72.07 208.6,72.71 208.6,76.83 v207.01,78.42 | R74.1 v167.96,71.44
AUDIO_I2S_BCLK_DAC
  Top 0.203: U$8.36 192.43,74.64 192.09,74.3 191.13,74.3 189.55,75.88 185.1,75.88 184.47,76.52 184.47,79.38 183.83,80.01 R73.1
AUDIO_I2S_LRCLK_ADC  (via drill 0.35)
  Top 0.203: U$8.6 208.3,71.14 v208.91,71.75 | v209.55,82.87 209.55,83.5 208.91,84.14 203.84,84.14 201.93,82.23 169.54,82.23 168.91,82.87 R84.1
  Bottom 0.203: v208.91,71.75 209.55,72.39 v209.55,82.87
AUDIO_I2S_LRCLK_DAC  (via drill 0.35)
  Top 0.203: v188.91,75.25 184.15,75.25 183.51,75.88 183.51,76.2 183.52,76.2 183.52,78.1 182.56,79.06 R85.1 | U$8.35 191.92,75.14 v191.87,75.19
  Bottom 0.203: v188.91,75.25 191.87,75.25 v191.87,75.19
AUDIO_I2S_MCLK
  Top 0.203: R72.1 181.93,76.83 182.25,76.52 182.25,73.34 183.2,72.39 188.91,72.39 189.16,72.14 U$8.41
AUDIO_I2S_SD_ADC  (via drill 0.35)
  Top 0.203: U$1.2 173.35,77.54 173.92,78.11 182.25,78.11 182.88,77.47 182.88,73.98 183.51,73.34 v189.23,73.34 | v196.85,76.83 204.79,76.83 205.38,76.24 205.38,72.81 206.06,72.14 U$8.8
  Bottom 0.203: v189.23,73.34 192.09,73.34 195.58,76.83 v196.85,76.83
AUDIO_I2S_SD_DAC  (via drill 0.35)
  Top 0.203: U$8.37 193.2,74.14 192.41,73.34 190.5,73.34 189.55,74.3 v183.51,74.3 | U$1.27 160.85,71.24 161.61,70.48 172.72,70.48 173.67,71.44 173.67,73.34 174.31,73.98 174.31,76.52 174.62,76.83 177.8,76.83 179.07,75.56 179.71,75.56 180.97,74.3 v181.61,74.3
  Bottom 0.203: v181.61,74.3 v183.51,74.3
AUDIO_RST  (via drill 0.35)
  Top 0.203: U$1.123 182.72,62.38 183.51,61.59 183.51,57.78 184.15,57.15 201.61,57.15 202.25,57.78 202.25,59.37 202.88,60.01 206.69,60.01 207.33,60.64 207.33,66.36 v207.01,66.67 | U$8.4 205.71,70.14 205.42,69.85 v205.42,68.9
  Bottom 0.203: v205.42,68.9 205.42,68.26 v207.01,66.67
AUDIO_SPI_MCLK  (via drill 0.35)
  Top 0.203: U$1.126 184.4,63.88 184.78,63.5 187.32,63.5 187.96,64.14 v187.96,68.26 | U$8.42 188.8,71.64 187.96,70.8 v187.96,70.17
  Bottom 0.203: v187.96,70.17 v187.96,68.26
AUDIO_SPI_MISO  (via drill 0.35)
  Top 0.203: U$1.124 183.5,62.88 184.47,61.91 189.87,61.91 v191.13,63.18 | v195.26,66.04 195.9,66.04 196.22,66.36 196.22,70.26 195.84,70.64 U$8.44
  Bottom 0.203: v191.13,63.18 193.99,66.04 v195.26,66.04
AUDIO_SPI_MOSI  (via drill 0.35)
  Top 0.203: U$1.43 155.22,69.89 158.12,66.99 161.61,66.99 162.56,66.04 v162.88,66.04 | v165.74,66.04 167.64,66.04 v170.18,68.58 | v182.56,69.85 183.51,69.85 184.15,69.22 188.28,69.22 190.2,71.14 U$8.43
  Bottom 0.203: v182.56,69.85 171.45,69.85 v170.18,68.58 | v162.88,66.04 v165.74,66.04
AUDIO_SPI_MS
  Top 0.203: U$1.125 184.03,63.38 184.87,62.55 188.59,62.55 189.55,63.5 189.55,69.53 190.16,70.14 U$8.45
B2  (via drill 0.35)
  Top 0.203: v168.28,55.24 168.91,55.24 169.35,54.8 U$1.99 | U$2.31 151.13,40.32 151.76,40.96 165.1,40.96 166.05,41.91 166.05,46.99 167,47.94 v167,51.44
  Bottom 0.203: v168.28,55.24 167.64,55.24 167,54.61 v167,51.44
B3  (via drill 0.35)
  Top 0.203: U$2.26 157.85,35.19 157.48,35.56 v157.48,40.01 | U$1.79 159.35,52.35 158.43,51.44 158.43,48.9 157.48,47.94 v157.48,47.31
  Bottom 0.203: v157.48,47.31 v157.48,40.01
B4  (via drill 0.35)
  Top 0.203: U$2.24 162.19,35.19 162.56,35.56 v162.56,40.01 | U$1.102 170.85,51.79 v170.81,51.75 | v165.42,49.21 162.56,46.35 v162.56,43.18
  Bottom 0.203: v162.56,40.01 v162.56,43.18 | v170.81,51.75 170.81,51.12 170.18,50.48 166.69,50.48 v165.42,49.21
B5  (via drill 0.35)
  Top 0.203: U$2.21 v163.83,40.01 | U$1.37 155.09,72.89 157.48,70.5 157.48,68.58 158.43,67.63 163.19,67.63 163.83,66.99 v163.83,60.96 | v163.83,43.18 v163.83,46.35
  Bottom 0.203: v163.83,40.01 v163.83,43.18 | v163.83,46.35 v163.83,60.96
B6  (via drill 0.35)
  Top 0.203: U$2.19 167.27,37.73 167.64,38.1 v167.64,41.27 | v174.62,54.61 174.62,56.2 173.67,57.15 173.67,69.53 174.53,70.39 U$1.139
  Bottom 0.203: v167.64,41.27 167.64,46.67 168.28,47.31 173.99,47.31 174.62,47.94 v174.62,54.61
B7  (via drill 0.35)
  Top 0.203: U$1.140 174.07,70.89 173.04,69.85 172.72,69.53 v172.72,65.72 | v161.29,40.01 U$2.23 | v161.29,43.18 161.29,46.35 165.1,50.16 v165.1,51.44
  Bottom 0.203: v165.1,51.44 165.1,60.33 165.74,60.96 166.69,60.96 167.32,61.59 167.32,63.5 167.96,64.14 171.77,64.14 172.72,65.09 v172.72,65.72 | v161.29,40.01 v161.29,43.18
BUZZER  (via drill 0.35)
  Top 0.203: U$1.36 155.35,74.89 152.72,77.52 152.72,78.74 152.08,79.38 v151.45,79.38 | v148.59,79.38 147.32,79.38 146.69,80.01 146.69,81.28 145.73,82.23 145.73,88.58 145.1,89.22 v133.03,89.22 | v129.22,89.22 v113.67,89.22 | v87.95,89.22 83.5,89.22 82.87,88.58 82.87,85.72 82.55,85.41 v81.92,85.41 | v106.68,89.22 v91.44,89.22 | R71.2 52.07,78.74 52.7,79.38 52.7,82.23 53.34,82.87 v60.64,82.87 | v63.18,84.77 63.82,85.41 v79.69,85.41
  Bottom 0.203: v151.45,79.38 v148.59,79.38 | v133.03,89.22 v129.22,89.22 | v113.67,89.22 v106.68,89.22 | v91.44,89.22 v87.95,89.22 | v81.92,85.41 v79.69,85.41 | v63.18,84.77 61.28,82.87 v60.64,82.87
DBG_!RST  (via drill 0.35)
  Top 0.203: U$1.25 161.85,77.08 162.9,78.13 162.9,85.7 161.61,87 155.57,87 154.94,87.63 154.94,91.12 155.89,92.08 | 155.89,92.08 v147.96,92.08 | v211.46,84.77 203.2,84.77 201.29,82.87 173.04,82.87 172.4,83.5 172.4,91.44 171.77,92.08 v171.13,92.08 | v215.58,84.77 217.17,84.77 218.12,83.82 v218.12,52.7 | C16.1 R31.1 117.47,96.52 118.65,97.69 B1.4 B1.3 127.64,92.7 128.27,92.08 v129.22,92.08 | v133.03,92.08 v144.78,92.08 | v167,92.08 155.89,92.08
  Bottom 0.203: v147.96,92.08 v144.78,92.08 | v211.46,84.77 v215.58,84.77 | v129.22,92.08 v133.03,92.08 | v171.13,92.08 v167,92.08 | R30.1 217.17,49.53 218.12,50.48 v218.12,52.7
DBG_JTAG_!TRST  (via drill 0.35)
  Top 0.203: U$1.134 177.1,67.89 177.8,68.58 v179.07,68.58 | v186.06,59.37 186.06,59.05 186.69,58.42 v201.29,58.42 | v182.56,68.58 185.1,68.58 186.06,67.63 v186.06,64.45
  Bottom 0.203: v186.06,64.45 v186.06,59.37 | v182.56,68.58 v179.07,68.58 | v201.29,58.42 R15.1
DBG_JTAG_TCK  (via drill 0.35)
  Top 0.203: U$1.109 177.98,55.38 179.07,54.29 v179.71,54.29 | v203.52,50.8 202.88,50.8 202.25,51.44 202.25,53.66 201.61,54.29 v182.88,54.29
  Bottom 0.203: v182.88,54.29 v179.71,54.29 | v203.52,50.8 R18.1
DBG_JTAG_TDI  (via drill 0.35)
  Top 0.203: v179.71,55.88 v179.7,55.88 U$1.110 | v182.88,55.88 v203.52,55.88
  Bottom 0.203: v182.88,55.88 v179.71,55.88 | v203.52,55.88 R16.1
DBG_JTAG_TDO  (via drill 0.35)
  Top 0.203: U$1.133 176.77,67.39 v177.16,66.99
  Bottom 0.203: v177.16,66.99 177.48,66.67 R19.1
DBG_JTAG_TMS  (via drill 0.35)
  Top 0.203: U$1.105 172.35,51.49 173.67,50.16 v179.71,50.16 | v182.88,52.7 199.71,52.7 200.34,53.34 v201.29,53.34
  Bottom 0.203: v179.71,50.16 180.34,50.16 180.97,50.8 180.97,52.07 181.61,52.7 v182.88,52.7 | v201.29,53.34 R17.1
DISPLAY_EN  (via drill 0.35)
  Top 0.203: U$2.28 155.31,35.19 154.94,35.56 v154.94,40.01 | v154.94,42.86 154.94,53.34 156.21,54.61 156.21,56.2 157.48,57.47 159.38,57.47 160.02,58.1 v160.02,58.74 | v160.02,60.96 v160.02,66.04 | U$1.22 163.35,73.18 v163.19,73.03
  Bottom 0.203: v154.94,40.01 v154.94,42.86 | v160.02,60.96 v160.02,58.74 | v163.19,73.03 162.56,72.39 161.61,72.39 161.29,72.07 161.29,70.48 160.02,69.22 v160.02,66.04
G2  (via drill 0.35)
  Top 0.203: U$2.8 181.61,31.75 180.97,31.11 v171.45,31.11 | v168.91,31.11 142.88,31.11 142.24,31.75 142.24,41.27 145.73,44.77 145.73,69.85 146.27,70.39 U$1.42
  Bottom 0.203: v171.45,31.11 v168.91,31.11
G3  (via drill 0.35)
  Top 0.203: U$2.10 178.81,35.19 177.8,36.2 177.8,41.27 177.16,41.91 172.09,41.91 169.23,44.77 v169.23,51.44 | v166.37,58.42 161.61,58.42 160.02,60.01 156.21,60.01 155.57,59.37 155.56,59.38 U$1.64
  Bottom 0.203: v169.23,51.44 169.23,52.39 169.54,52.7 169.54,55.56 167.96,57.15 167.96,57.78 167.32,58.42 v166.37,58.42
G4
  Top 0.203: U$2.36 145.15,35.19 144.78,35.56 144.78,40.64 146.69,42.55 153.03,42.55 154.31,43.81 154.31,53.34 155.57,54.61 155.57,56.4 155.09,56.88 U$1.69
G5  (via drill 0.35)
  Top 0.203: U$1.70 150.37,56.38 149.86,55.88 149.86,50.8 152.4,48.26 v152.4,43.5 | v177.8,33.66 177.8,33.02 177.16,32.38 v171.45,32.38 | v168.91,32.38 153.35,32.38 152.4,33.34 v152.4,40.01
  Bottom 0.203: v168.91,32.38 v171.45,32.38 | v177.8,33.66 177.8,36.83 176.9,37.73 U$2.11 | v152.4,40.01 v152.4,43.5
G6
  Top 0.203: U$1.97 168.35,44.38 171.45,41.27 174.62,41.27 175.26,40.64 175.26,36.2 176.26,35.19 U$2.12
G7
  Top 0.203: U$2.35 146.05,40.64 147.32,41.91 164.78,41.91 165.42,42.55 165.42,47.31 166.35,48.24 U$1.93
GND  (via drill 0.35, 0.4, 1)
  Top 0.203: v179.07,66.67 179.71,66.67 180.07,66.31 C13.2 | U$1.94 166.85,54.77 v166.37,55.24 | U$1.120 175.02,60.88 v174.31,61.59 | 212.14,75.56 C96.2 v213.68,77.15 | 212.14,75.56 C56.2 | v161.61,79.06 161.56,79.11 C2.2 | v174.31,64.45 174.31,65.41 174.79,65.89 U$1.130 | v161.61,47.94 161.93,48.26 C8.2 160.87,50.22 160.87,51.97 161.35,52.45 U$1.83 | U$1.107 173.35,54.6 173.67,54.93 v173.67,55.56 | v206.69,97.47 206.69,99.01 C81.1 | v177.48,71.44 177.8,71.12 179.71,71.12 180.02,70.8 R1.1 | v182.56,60.96 182.56,61.28 182.13,61.71 180.46,61.71 180.02,61.28 180.02,61.01 C12.2 | LED3.C v119.06,24.13 | LED4.C v148.27,24.13 | v38.73,53.02 R20.2 | v40.64,55.88 C35.2 | R28.2 v55.24,53.02 | v57.15,55.88 C39.2 | C37.2 v73.66,55.88 | v71.75,53.02 R24.2 | C36.2 v57.15,39.37 | v55.24,36.51 R22.2 | C38.2 v57.15,72.39 | v55.24,69.53 R26.2 | R12.2 v38.73,20 | v40.64,22.86 C94.2 | R13.2 v71.75,20 | v73.66,22.86 C24.2 | LED10.C v78.42,33.02 | v45.4,33.02 LED9.C | C18.2 v178.75,51.44 | C3.2 v148.59,72.39 | v140.65,71.12 C85.2 | IC13.7 v114.62,73.03 | IC13.8 v114.62,71.75 | IC2.7 v114.62,56.52 | IC2.8 v114.62,55.24 | v114.62,79.38 IC13.2 | IC13.4 v114.62,76.83 | v114.62,62.87 IC2.2 | v114.62,60.33 IC2.4 | IC13.6 v114.62,74.3 | IC2.6 v114.62,57.78 | C33.2 v122.56,85.41 | v153.35,79.38 C91.2 C89.2 | C84.1 v200.03,98.74 | v198.75,107 C83.2 | v209.23,97.47 R66.2 | v173.67,99.06 C72.1 | v195.26,99.06 195.26,99.69 194.68,100.28 C76.1 | R59.2 v194.94,97.79 | C71.2 v172.09,107 | v153.35,99.06 C70.1 | C47.2 v151.45,107 | LED7.C v100.33,82.55 | C44.2 v124.46,118.11 | Q2.2 v144.46,112.08 | v153.03,50.8 C1.2 C17.2 | v148.59,60.33 C7.2 | v156.21,61.28 155.82,60.88 U$1.61 | IC15.23 v73.66,79.38 | IC15.22 v74.93,79.38
  Top 0.203: IC15.21 v76.2,79.38 | IC15.20 v77.47,79.38 | IC15.19 v78.74,79.38 | IC15.18 v80.01,79.38 | IC15.17 v81.28,79.38 | IC15.16 v82.55,79.38 | IC15.12 v86.36,73.98 | C102.2 v70.48,78.11 | v73.66,69.53 IC15.2 | C30.2 v189.23,43.81 | LED5.C v177.48,24.13 | LED6.C v206.69,24.13 | IC7.13 v124.14,43.81 | LED8.C 98.42,52.19 v98.42,53.66 | v124.14,67.63 122.6,67.63 C86.2 | v193.99,68.26 193.99,68.9 194.24,69.14 U$8.47 | C54.2 v205.74,61.28 | v213.68,75.25 212.46,75.25 212.14,75.56 | v213.68,73.34 C48.2 | v213.68,71.44 C49.2 | C58.2 v213.68,68.9 | v213.68,66.99 C59.2 | U$8.2 207.72,69.14 208.28,68.58 v208.28,67.63 | U$8.11 207.66,73.64 v207.96,73.34 | C55.2 v195.26,60.96 | v197.17,60.96 C98.2 | C57.2 C97.2 v189.55,78.42 | v190.82,65.41 190.77,65.45 C11.2 C50.2 | C9.2 179.39,53.34 v179.71,53.02 | C14.2 180.02,73.07 180.02,74.3 v179.71,74.61 | v194.31,77.47 194.94,77.47 195.23,77.19 U$8.33 | C66.1 v166.37,112.71 | C62.1 v157.8,112.71 | C16.2 v123.51,94.61 | v127.64,100.33 B1.2 127.55,101.6 118.11,101.6 118.2,101.69 B1.1 | OK1.5 120.97,112.29 v120.97,110.81 | LED12.C v137.48,104.78 | LED13.C v141.29,104.78 | v166.37,73.03 166.35,73.05 U$1.16 | IC3.6 22.54,129.54 v17.46,129.54 | C93.2 v103.5,125.73 | C53.2 v208.28,80.64 | U$8.16 206.69,76.17 v206.69,77.15 | v197.49,68.26 197.73,68.02 U$8.50 | C51.2 v203.84,61.28 | v201.29,61.28 C52.2 | U$8.GND 201.29,72.07 v201.29,68.26 | C31.2 166.64,42.18 v167,42.55 | C28.2 v122.56,52.7 | v114.62,38.73 IC7.8 | v159.07,72.71 158.85,72.92 U$1.31 | C92.2 v158.75,84.45 | C90.2 v160.66,84.45 | C15.2 v166.05,80.33 | v171.13,80.33 C88.2 | v130.81,64.45 130.81,65.3 IC12.4 | U$1.38 153.68,72.39 153.67,72.39 153.22,72.39 153.03,72.58 v153.03,73.34
  Top 0.203: IC15.13 86.63,81.28 v87.63,81.28 | R9.2 46.67,110.49 47.31,109.86 IC8.7 | IC9.1 73.66,106.36 74.3,107 R41.2 | v17.46,15.24 v17.45,15.25 IC1.7 | Q4.2 v40.64,79.69 | IC15.15 v83.82,79.38 | U$1.51 155.74,65.89 v156.21,66.36 | C5.2 v21.91,29.21 | C10.2 v21.91,27.3 | v14.61,25.4 R6.1 | v18.1,22.23 18.1,23.94 IC1.21 | IC1.18 20.05,22.28 v20,22.23 | v15.88,25.4 15.51,25.03 IC1.25 | C6.2 150.45,66.31 v151.13,66.99 | U$8.40 U$8.39 | U$8.39 U$8.38 | v193.99,73.03 194.11,73.14 U$8.39
  Top 0.406: v24.13,20.32 C4.2 | IC1.26 IC1.25 | C43.- v20.32,117.47 | v16.51,118.75 C42.2 | v44.45,118.11 C25.2 | v42.55,118.11 C32.2 | IC11.2 73.86,122.76 72.71,121.61 R10.2 v71.12,120.65 | v61.28,98.11 61.23,98.16 C46.2 | v187.01,28.57 186.96,28.62 C20.2 C19.2 | v82.55,117.16 C40.1 | C101.2 v86.36,109.86 | v69.85,120.65 C34.1 | C87.2 v43.18,125.73 | C26.1 v47.62,134.62 | C103.2 v143.19,85.41 | C104.2 4.59,12.65 R34.1 v4.45,11.43 | v11.11,20 v11.1,19.99 J1.GND | v84.77,127.64 C105.2 | R43.2 v84.77,135.57 | C106.2 v211.14,63.5
  Top 0.508: LED11.C v18.41,100.33 | C95.2 v20.95,98.42 | C41.2 v23.5,112.39
  Top 1.016: IC3.3 23.5,120.02 22.63,119.15 C43.- | R36.1 v29.84,126.36